# Altium schematic sheet AMS1117-3.31_AMS1117-3.3.schdoc
size 124 x 101 mm
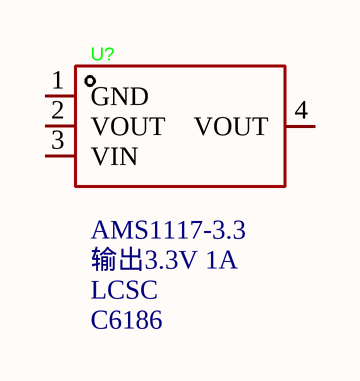
[diagram p0: AMS1117-3.31_AMS1117-3.3.schdoc]

## Parts
U?  LCSC Part Name: 输出3.3V 1A  Supplier Part: C6186  Supplier: LCSC  [SOT-223-3_L6.5-W3.4-P2.30-LS7.0-BR]  (hidden comment: AMS1117-3.3)

## Nets

Not connected (* = marked no-connect by the designer): U? 1(GND) 2(VOUT) 3(VIN) 4(VOUT)

## Library data of the parts
U? = AMS1117-3.3_C6186: Manufacturer: AMS; Add into BOM: yes; Output Type: Fixed; Voltage - Supply: 16V; Output Voltage: 3.3V; Output Current: 1A; Power Supply Rejection Ratio (PSRR): 72dB@(120Hz); Voltage Dropout: 1.1V@(800mA); standby current: 5mA; Noise: 0.003%Vout; Output Configuration: Positive; Number of Outputs: 1; Symbol: AMS1117-3.3; Device: AMS1117-3.3_C6186; Manufacturer Part: AMS1117-3.3; Supplier Footprint: SOT-223; JLCPCB Part Class: Basic Part; Datasheet: https://item.szlcsc.com/datasheet/AMS1117-3.3/6652.html; Convert to PCB: yes; Features: Over Current Protection；Over Temperature Protection; Operating Temperature: -40℃~+125℃